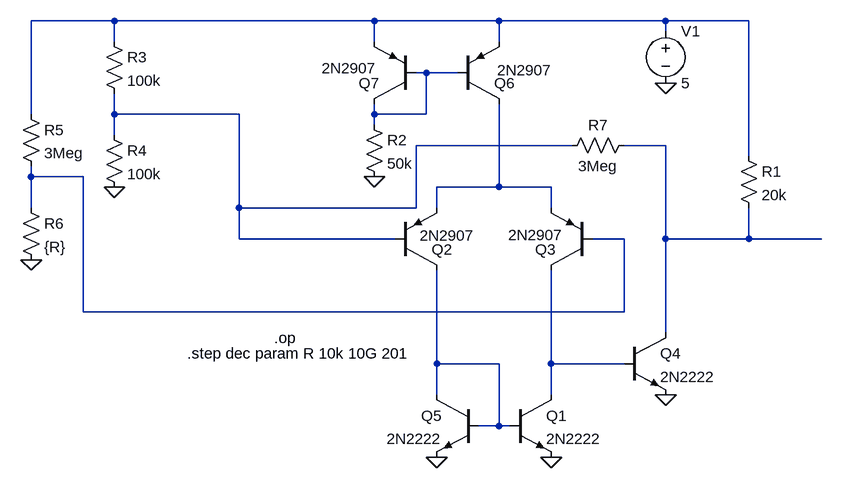
[diagram p0: schematic Discrete_Comparator_Resistor_Compare.asc]
Discrete_Comparator_Resistor_Compare.asc, the LTspice schematic file:
Version 4
SHEET 1 880 680
WIRE -432 -432 -560 -432
WIRE -32 -432 -432 -432
WIRE 160 -432 -32 -432
WIRE 416 -432 160 -432
WIRE 544 -432 416 -432
WIRE 416 -416 416 -432
WIRE -432 -400 -432 -432
WIRE -32 -400 -32 -432
WIRE 160 -400 160 -432
WIRE 48 -352 32 -352
WIRE 96 -352 48 -352
WIRE -560 -288 -560 -432
WIRE -432 -288 -432 -320
WIRE -240 -288 -432 -288
WIRE -32 -288 -32 -304
WIRE 48 -288 48 -352
WIRE 48 -288 -32 -288
WIRE -32 -272 -32 -288
WIRE -432 -256 -432 -288
WIRE 272 -240 32 -240
WIRE 416 -240 352 -240
WIRE 544 -224 544 -432
WIRE -560 -192 -560 -208
WIRE -480 -192 -560 -192
WIRE 160 -176 160 -304
WIRE 160 -176 64 -176
WIRE 240 -176 160 -176
WIRE -560 -144 -560 -192
WIRE -240 -144 -240 -288
WIRE 32 -144 32 -240
WIRE 32 -144 -240 -144
WIRE 64 -144 64 -176
WIRE 240 -144 240 -176
WIRE -240 -96 -240 -144
WIRE 0 -96 -240 -96
WIRE 352 -96 304 -96
WIRE 416 -96 416 -240
WIRE 544 -96 544 -144
WIRE 544 -96 416 -96
WIRE 656 -96 544 -96
WIRE -480 16 -480 -192
WIRE 352 16 352 -96
WIRE 352 16 -480 16
WIRE 416 48 416 -96
WIRE 64 96 64 -48
WIRE 160 96 64 96
WIRE 240 96 240 -48
WIRE 352 96 240 96
WIRE 64 144 64 96
WIRE 240 144 240 96
WIRE 160 192 160 96
WIRE 160 192 128 192
WIRE 176 192 160 192
FLAG 64 240 0
FLAG 240 240 0
FLAG 416 144 0
FLAG 416 -336 0
FLAG -32 -192 0
FLAG -432 -176 0
FLAG -560 -64 0
SYMBOL npn 176 144 R0
SYMATTR InstName Q1
SYMATTR Value 2N2222
SYMBOL pnp 0 -48 M180
WINDOW 3 38 53 Left 2
SYMATTR InstName Q2
SYMATTR Value 2N2907
SYMBOL pnp 304 -48 R180
WINDOW 3 45 54 Left 2
SYMATTR InstName Q3
SYMATTR Value 2N2907
SYMBOL npn 352 48 R0
SYMATTR InstName Q4
SYMATTR Value 2N2222
SYMBOL npn 128 144 M0
SYMATTR InstName Q5
SYMATTR Value 2N2222
SYMBOL voltage 416 -432 R0
SYMATTR InstName V1
SYMATTR Value 5
SYMBOL res 528 -240 R0
SYMATTR InstName R1
SYMATTR Value 20k
SYMBOL pnp 96 -304 M180
WINDOW 3 61 52 Left 2
SYMATTR InstName Q6
SYMATTR Value 2N2907
SYMBOL pnp 32 -304 R180
WINDOW 3 60 55 Left 2
SYMATTR InstName Q7
SYMATTR Value 2N2907
SYMBOL res -48 -288 R0
SYMATTR InstName R2
SYMATTR Value 50k
SYMBOL res -448 -416 R0
SYMATTR InstName R3
SYMATTR Value 100k
SYMBOL res -448 -272 R0
SYMATTR InstName R4
SYMATTR Value 100k
SYMBOL res -576 -304 R0
SYMATTR InstName R5
SYMATTR Value 3Meg
SYMBOL res -576 -160 R0
SYMATTR InstName R6
SYMATTR Value {R}
SYMBOL res 368 -256 R90
WINDOW 0 0 56 VBottom 2
WINDOW 3 32 56 VTop 2
SYMATTR InstName R7
SYMATTR Value 3Meg
TEXT -186 56 Left 2 !.op
TEXT -320 80 Left 2 !.step dec param R 10k 10G 201

The netlist it stands for:
* Discrete_Comparator_Resistor_Compare.asc
Q1 N008 N007 0 0 2N2222
Q2 N007 N003 N006 0 2N2907
Q3 N008 N005 N006 0 2N2907
Q4 N004 N008 0 0 2N2222
Q5 N007 N007 0 0 2N2222
V1 N001 0 5
R1 N001 N004 20k
Q6 N006 N002 N001 0 2N2907
Q7 N002 N002 N001 0 2N2907
R2 N002 0 50k
R3 N001 N003 100k
R4 N003 0 100k
R5 N001 N005 3Meg
R6 N005 0 {R}
R7 N004 N003 3Meg
.model NPN NPN
.model PNP PNP
.lib standard.bjt
.op
.step dec param R 10k 10G 201
.backanno
.end